# Altium schematic sheet SDCARD_FLASH.SchDoc
size 420 x 297 mm; SheetNumber: 13; SheetTotal: 32
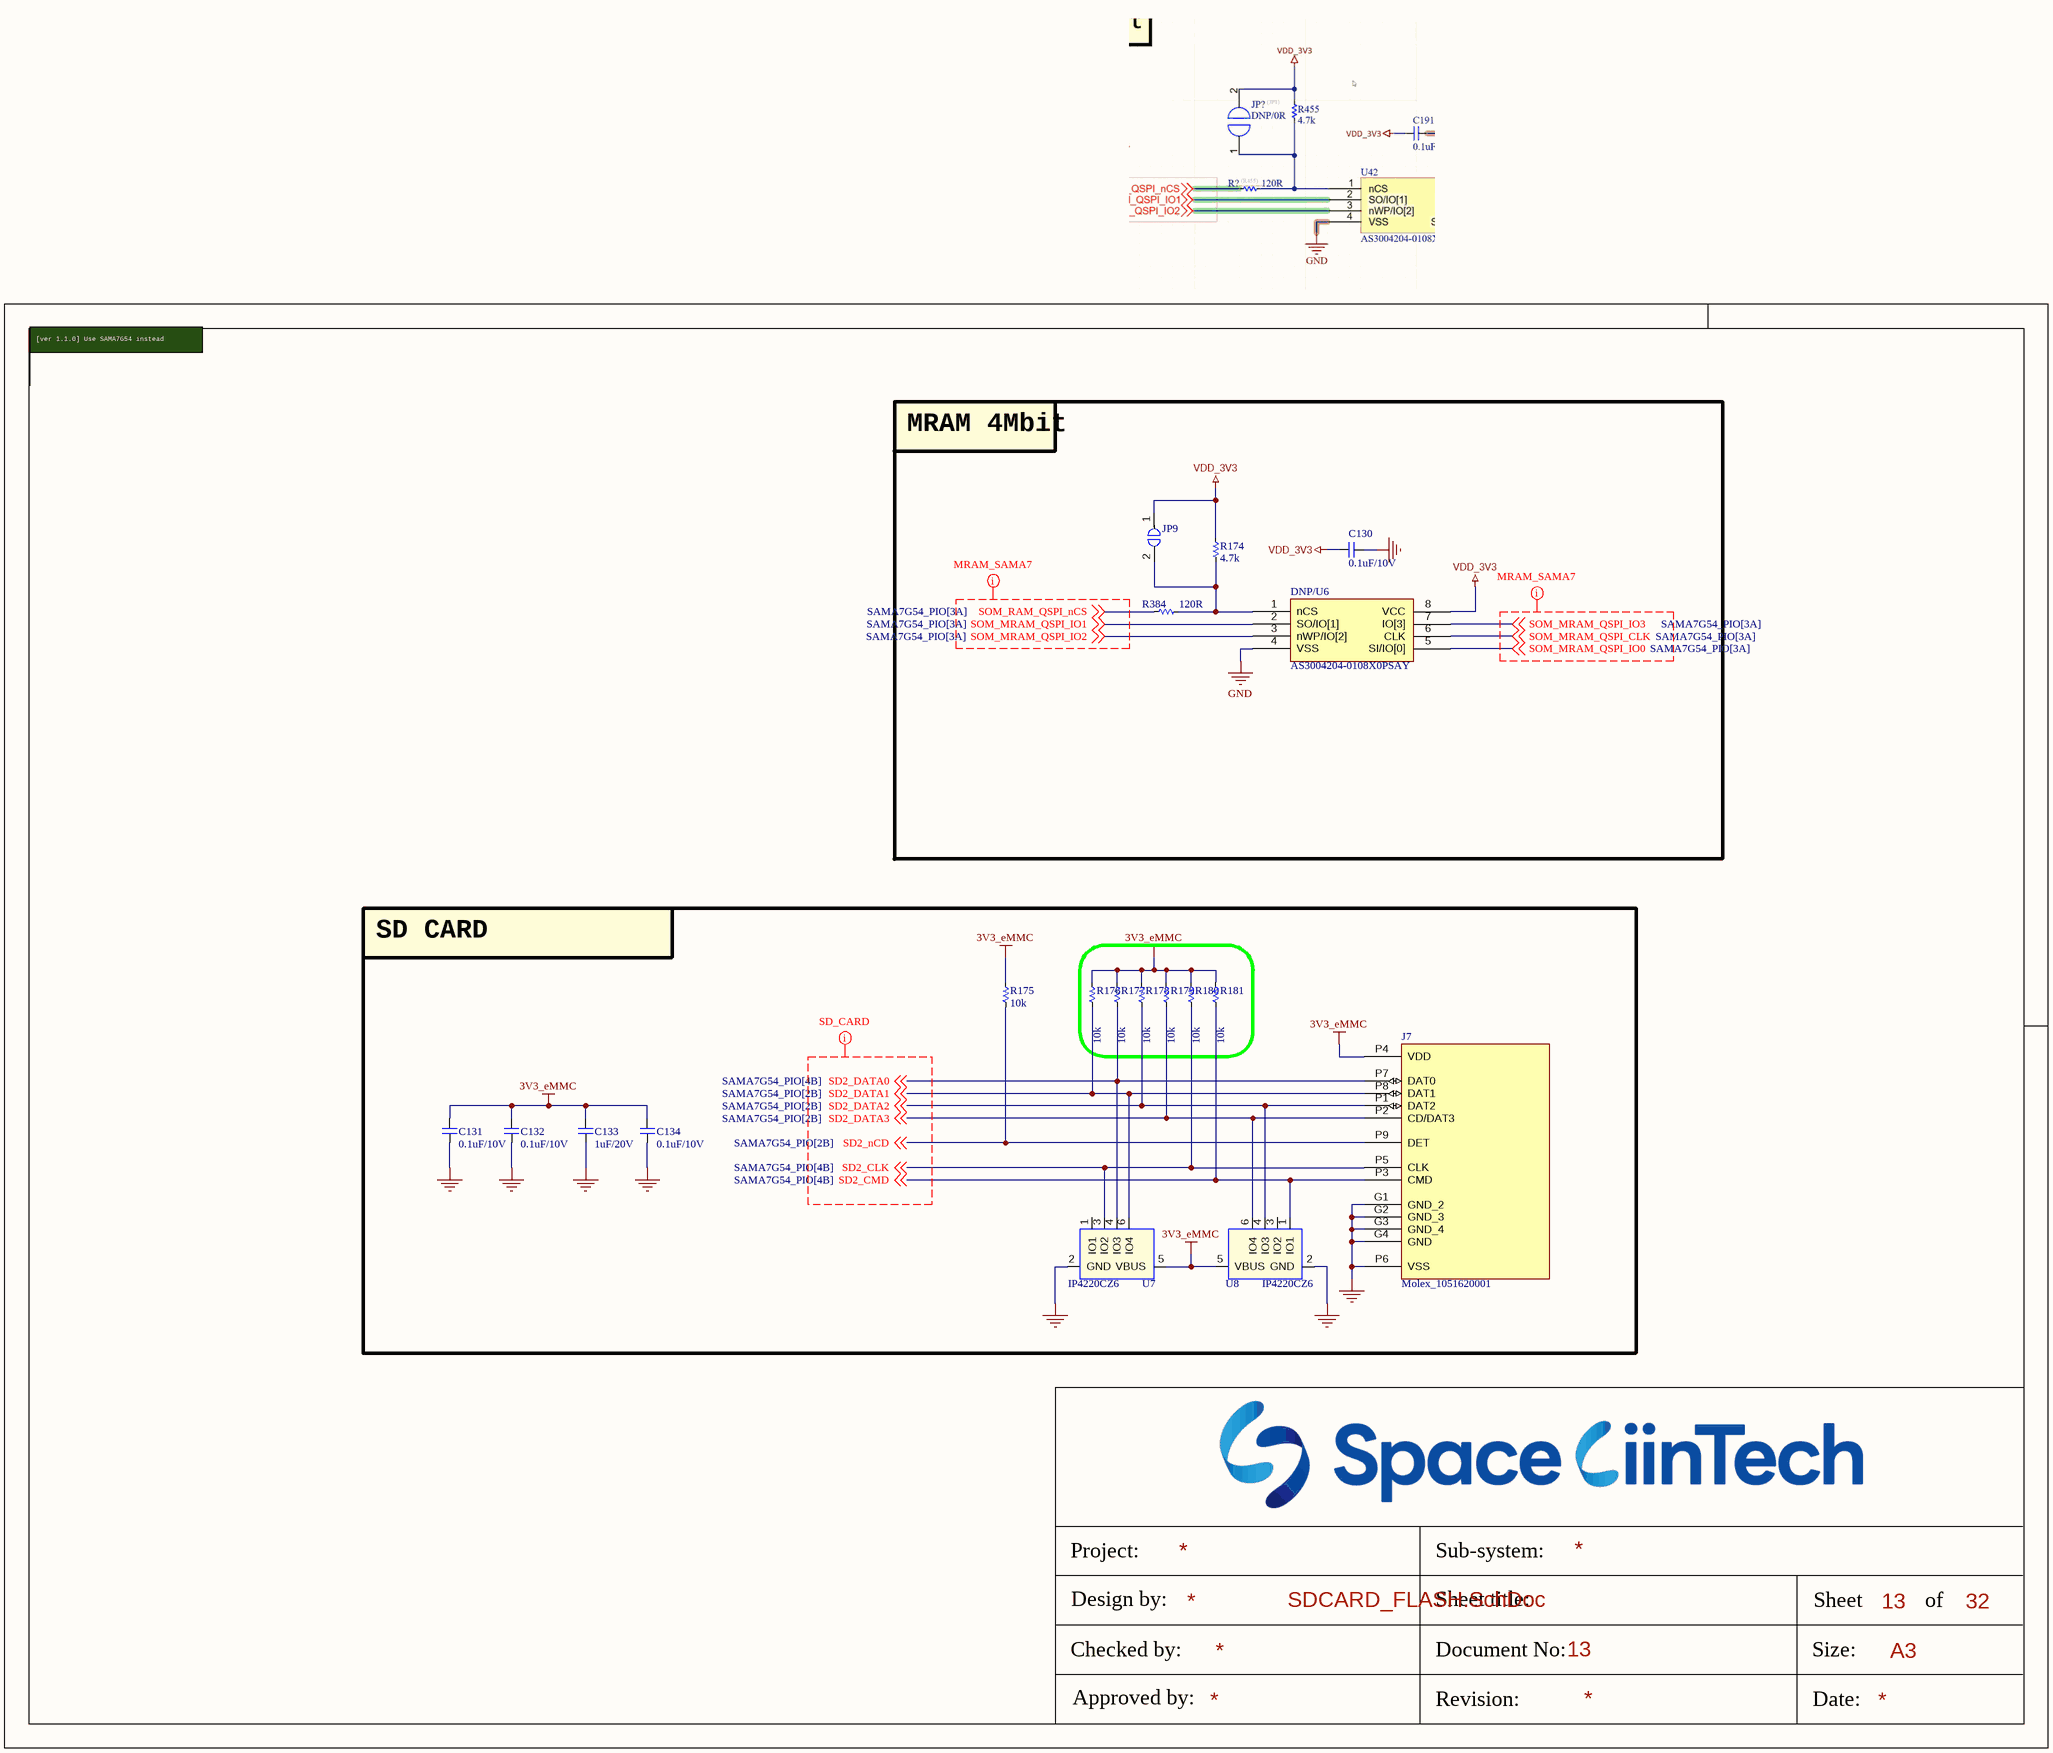
[diagram p0: SDCARD_FLASH.SchDoc]

## Parts
C130  0.1uF/10V  [CAP_C_1005X50_L]
C131  0.1uF/10V  [CAP_C_1005X50_L]
C132  0.1uF/10V  [CAP_C_1005X50_L]
C133  1uF/20V  [CAP_C_1005X50_L]
C134  0.1uF/10V  [CAP_C_1005X50_L]
DNP/U6  AS3004204-0108X0PSAY  [SOIC127P790X216-8]
J7  Molex_1051620001  [Molex_1051620001]
JP9  (no value)  [JUMPER_1608]
R174  4.7k  [RES_C_1005x30_L]
R175  10k  [RES_C_1005x30_L]
R176  10k  [RES_C_1005x30_L]
R177  10k  [RES_C_1005x30_L]
R178  10k  [RES_C_1005x30_L]
R179  10k  [RES_C_1005x30_L]
R180  10k  [RES_C_1005x30_L]
R181  10k  [RES_C_1005x30_L]
R384  120R  [RES_C_1005x30_L]
U7  IP4220CZ6  [DIODE_SOT457_1P7X3P1_NEX]
U8  IP4220CZ6  [DIODE_SOT457_1P7X3P1_NEX]

## Blocks framed on the sheet
MRAM 4Mbit: C130 DNP/U6 JP9 R174 R384
SD CARD: C131-C134 J7 R175-R181 U7 U8

## Nets
3V3_eMMC: C131.2 C132.2 C133.2 C134.2 J7.P4(VDD) R175.2 R176.2 R177.2 R178.2 R179.2 R180.2 R181.2 U7.5(VBUS) U8.5(VBUS)
GND: C130.1 C131.1 C132.1 C133.1 C134.1 DNP/U6.4(VSS) J7.G1(GND_2) J7.G2(GND_3) J7.G3(GND_4) J7.G4(GND) J7.P6(VSS) U7.2(GND) U8.2(GND)
VDD_3V3: C130.2 DNP/U6.8(VCC) JP9.1 R174.2
SD2_CLK: J7.P5(CLK) R180.1 U7.3(IO2) ; off-sheet SD2_CLK
SD2_CMD: J7.P3(CMD) R181.1 U8.1(IO1) ; off-sheet SD2_CMD
SD2_DATA0: J7.P7(DAT0) R177.1 U7.4(IO3) ; off-sheet SD2_DATA0
SD2_DATA1: J7.P8(DAT1) R176.1 U7.6(IO4) ; off-sheet SD2_DATA1
SD2_DATA2: J7.P1(DAT2) R178.1 U8.4(IO3) ; off-sheet SD2_DATA2
SD2_DATA3: J7.P2(CD/DAT3) R179.1 U8.6(IO4) ; off-sheet SD2_DATA3
SD2_nCD: J7.P9(DET) R175.1 ; off-sheet SD2_nCD
SOM_MRAM_QSPI_CLK: DNP/U6.6(CLK) ; off-sheet SOM_MRAM_QSPI_CLK
SOM_MRAM_QSPI_IO0: DNP/U6.5(SI/IO[0]) ; off-sheet SOM_MRAM_QSPI_IO0
SOM_MRAM_QSPI_IO1: DNP/U6.2(SO/IO[1]) ; off-sheet SOM_MRAM_QSPI_IO1
SOM_MRAM_QSPI_IO2: DNP/U6.3(nWP/IO[2]) ; off-sheet SOM_MRAM_QSPI_IO2
SOM_MRAM_QSPI_IO3: DNP/U6.7(IO[3]) ; off-sheet SOM_MRAM_QSPI_IO3
SOM_RAM_QSPI_nCS: R384.1 ; off-sheet SOM_RAM_QSPI_nCS
NetDNP/U6_1: DNP/U6.1(nCS) JP9.2 R174.1 R384.2

Not connected (* = marked no-connect by the designer): U7 1(IO1); U8 3(IO2)

## Layout directives
net class MRAM_SAMA7: SOM_MRAM_QSPI_CLK, SOM_MRAM_QSPI_IO0, SOM_MRAM_QSPI_IO1, SOM_MRAM_QSPI_IO2, SOM_MRAM_QSPI_IO3, SOM_RAM_QSPI_nCS
net class SD_CARD: SD2_CLK, SD2_CMD, SD2_DATA0, SD2_DATA1, SD2_DATA2, SD2_DATA3, SD2_nCD

## Notes on the sheet
- [ver 1.1.0] Use SAMA7G54 instead
- Project:
- Sub-system:
- Design by:
- Sheet title:
- Sheet
- A3
- of
- Checked by:
- Approved by:
- Revision:
- Document No:
- Size:
- Date:

## Library data of the parts
C130-C132 C134 = _CAP_C_2: CAP
C133 = _CAP_C_2: CAP CHIP
DNP/U6 = IC_RAM_AS3004204-0108X0PSAY
J7 = Molex_1051620001: 9 (8 + 1) Position Card Connector Secure Digital - microSDâ„¢ Surface Mount, Right Angle Gold; MF: Molex; SnapEDA_Link: https://www.snapeda.com/parts/1051620001/Molex/view-part/?ref=snap; Package: None; Value: *; MP: 1051620001; Check_prices: https://www.snapeda.com/parts/1051620001/Molex/view-part/?ref=eda
JP9 = JUMPER_1_1
R174-R181 R384 = _RES_B_2: RES
U7 U8 = IP4220CZ6_0: P/N: 132D42200S; PCB Footprint: SOT23-6L; CLABCONF0: =SB-UCMIMX93